# Altium schematic sheet IM.SchDoc: SIGMA-TEAM
size A2; DrawnBy: zfz; Revision: V1.0; SheetNumber: 1; SheetTotal: 1
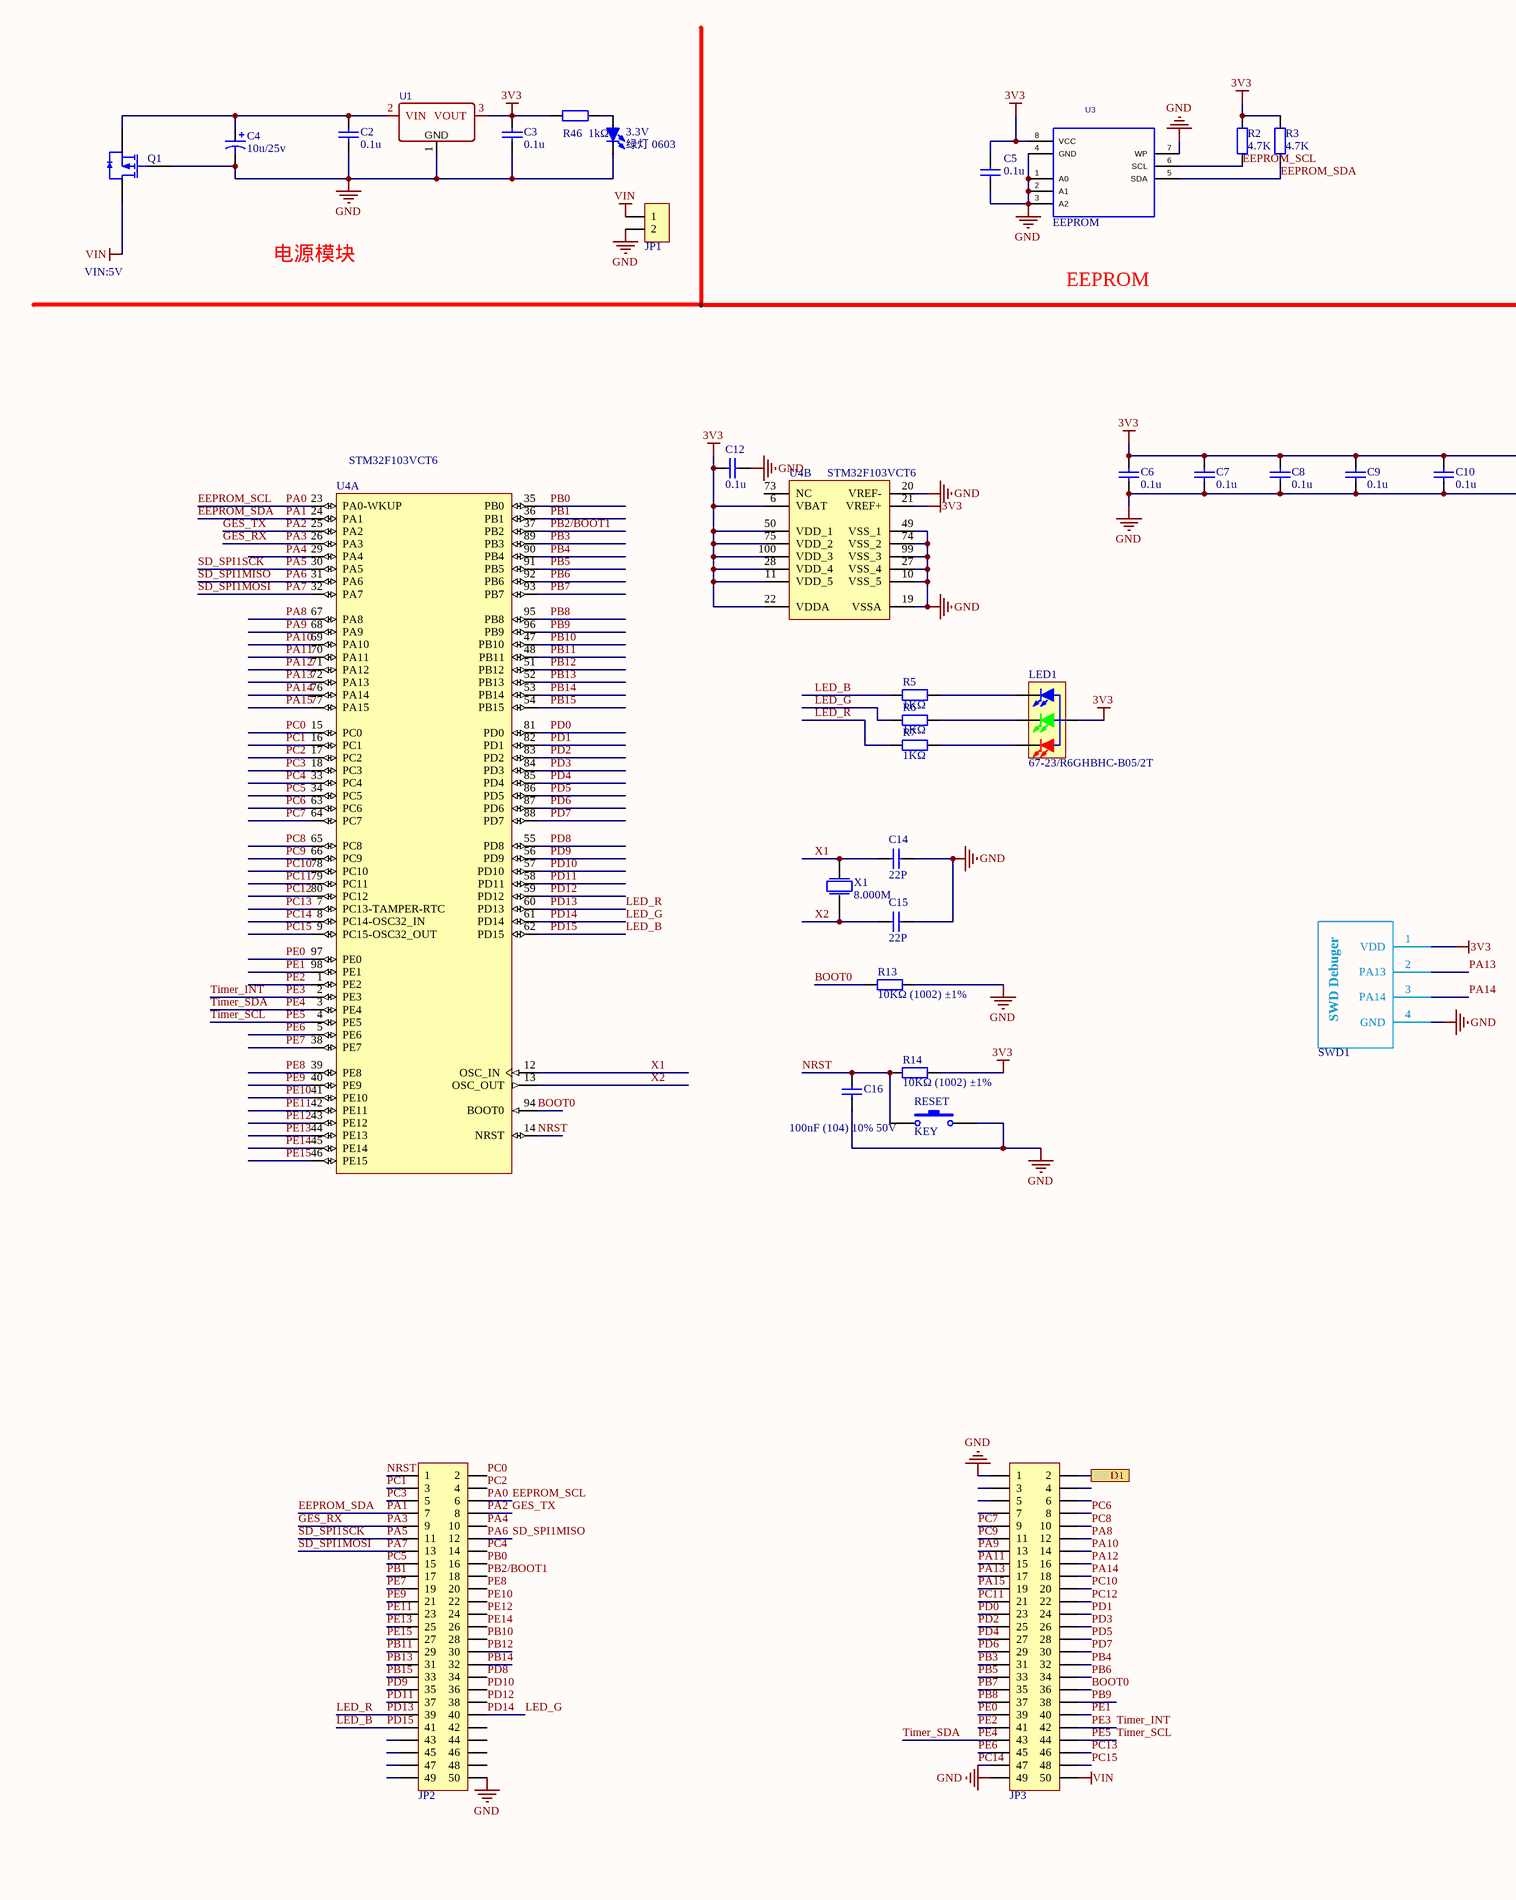
[diagram p0: IM.SchDoc, left]
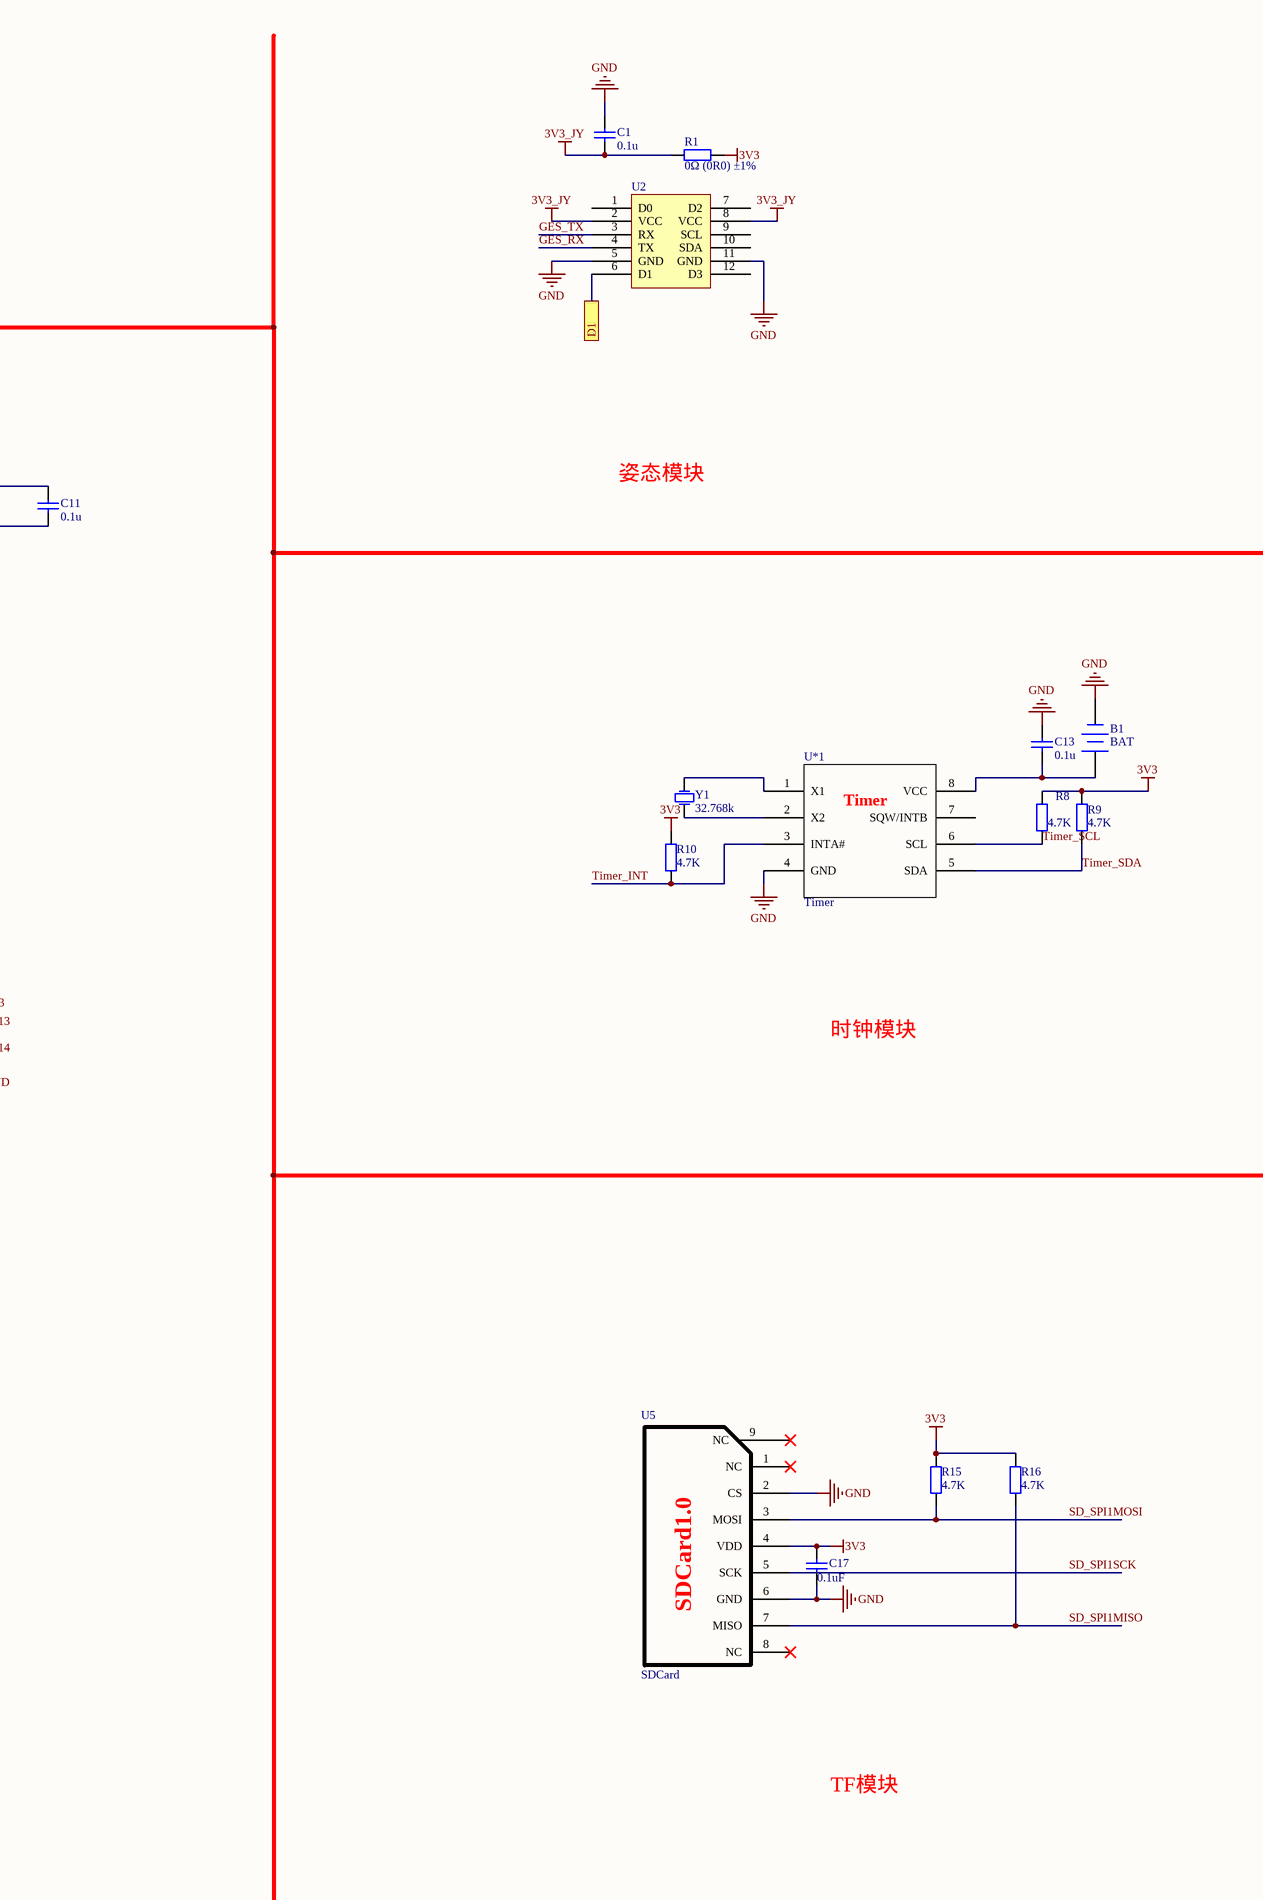
[diagram p1: IM.SchDoc, right]

## Parts
3.3V  绿灯 0603  [0603_LED]
B1  BAT  [BAT]
C1  0.1u  [0603_C]
C2  0.1u  [0603_C]
C3  0.1u  [0603_C]
C4  10u/25v  [SMD-3225-2P]
C5  0.1u  [0603_C]
C6  0.1u  [0603_C]
C7  0.1u  [0603_C]
C8  0.1u  [0603_C]
C9  0.1u  [0603_C]
C10  0.1u  [0603_C]
C11  0.1u  [0603_C]
C12  0.1u  [0603_C]
C13  0.1u  [0603_C]
C14  22P  [0603_C]
C15  22P  [0603_C]
C16  100nF (104) 10% 50V  [0603_C]
C17  0.1uF  [0603_C]
JP1  HDR-1X2  [HDR2.54-LI-2P]  (value not drawn)
JP2  Header 2X25  [HDR2.54-LI-2X25P]  (value not drawn)
JP3  Header 2X25  [HDR2.54-LI-2X25P]  (value not drawn)
LED1  67-23/R6GHBHC-B05/2T  [LED 3528-4Pin]
Q1  AO3401A P道沟  [SOT-23(SOT-23-3)]  (value not drawn)
R1  0Ω (0R0) ±1%  [0603_R]
R2  4.7K  [0603_R]
R3  4.7K  [0603_R]
R5  1KΩ  [0603_R]
R6  1KΩ  [0603_R]
R7  1KΩ  [0603_R]
R8  4.7K  [0603_R]
R9  4.7K  [0603_R]
R10  4.7K  [0603_R]
R13  10KΩ (1002) ±1%  [0603_R]
R14  10KΩ (1002) ±1%  [0603_R]
R15  4.7K  [0603_R]
R16  4.7K  [0603_R]
R46  1kΩ  [0603_R]
RESET  KEY  [key-2]
SWD1  SWD  [HDR2.54-LI-4P]  (value not drawn)
U1  HT7533/ME6210A33PG  [SOT-89(SOT-89-3)]  (value not drawn)
U2  JY901  [JY-901]  (value not drawn)
U3  value EEPROM  [SOP8_N]  (hidden comment: AT24C02)
U4  STM32F103VCT6  [LQFP100 14x14_N]  (parts A,B of 2)
U5  SDCard  [TF-Micro]
U*1  Timer
X1  8.000M  [OSC 5032-2P]
Y1  value 32.768k  [OSC 3215-2P]  (hidden comment: 无源晶振)

## Ports
D1

## Nets
3V3: C3.2 C5.2 C6.2 C7.2 C8.2 C9.2 C10.2 C11.2 C12.1 C17.1 LED1.4(A) R1.2 R2.1 R3.1 R8.2 R9.2 R10.2 R14.2 R15.1 R16.1 R46.1 SWD1.1(VDD) U1.3(VOUT) U3.8(VCC) U4.6(VBAT) U4.11(VDD_5) U4.21(VREF+) U4.22(VDDA) U4.28(VDD_4) U4.50(VDD_1) U4.75(VDD_2) U4.100(VDD_3) U5.4(VDD)
3V3_JY: C1.1 R1.1 U2.2(VCC) U2.8(VCC)
GND: 3.3V.K B1.2(-) C1.2 C2.1 C3.1 C4.2 C5.1 C6.1 C7.1 C8.1 C9.1 C10.1 C11.1 C12.2 C13.2 C14.2 C15.2 C16.1 C17.2 JP1.2 JP2.50 JP3.1 JP3.49 Q1.1(G) R13.2 RESET.2 SWD1.4(GND) U1.1(GND) U2.5(GND) U2.11(GND) U3.1(A0) U3.2(A1) U3.3(A2) U3.4(GND) U3.7(WP) U4.10(VSS_5) U4.19(VSSA) U4.20(VREF-) U4.27(VSS_4) U4.49(VSS_1) U4.74(VSS_2) U4.99(VSS_3) U5.2(CS) U5.6(GND) U*1.4(GND)
VIN: JP1.1 JP3.50 Q1.3(D)
BOOT0: JP3.36 R13.1 U4.94(BOOT0)
D1: JP3.2 U2.6(D1) ; port D1
EEPROM_SCL: JP2.6 R2.2 U3.6(SCL) U4.23(PA0-WKUP)  [also labelled PA0]
EEPROM_SDA: JP2.7 R3.2 U3.5(SDA) U4.24(PA1)  [also labelled PA1]
GES_RX: JP2.9 U2.4(TX) U4.26(PA3)  [also labelled PA3]
GES_TX: JP2.8 U2.3(RX) U4.25(PA2)  [also labelled PA2]
LED_B: JP2.41 R5.1 U4.62(PD15)  [also labelled PD15]
LED_G: JP2.40 R6.1 U4.61(PD14)  [also labelled PD14]
LED_R: JP2.39 R7.1 U4.60(PD13)  [also labelled PD13]
NRST: C16.2 JP2.1 R14.1 RESET.1 U4.14(NRST)
PA4: JP2.10 U4.29(PA4)
PA5: JP2.11 U4.30(PA5) U5.5(SCK)  [also labelled SD_SPI1SCK]
PA6: JP2.12 R16.2 U4.31(PA6) U5.7(MISO)  [also labelled SD_SPI1MISO]
PA7: JP2.13 R15.2 U4.32(PA7) U5.3(MOSI)  [also labelled SD_SPI1MOSI]
PA8: JP3.12 U4.67(PA8)
PA9: JP3.13 U4.68(PA9)
PA10: JP3.14 U4.69(PA10)
PA11: JP3.15 U4.70(PA11)
PA12: JP3.16 U4.71(PA12)
PA13: JP3.17 SWD1.2(PA13) U4.72(PA13)
PA14: JP3.18 SWD1.3(PA14) U4.76(PA14)
PA15: JP3.19 U4.77(PA15)
PB0: JP2.16 U4.35(PB0)
PB1: JP2.17 U4.36(PB1)
PB2/BOOT1: JP2.18 U4.37(PB2)
PB3: JP3.31 U4.89(PB3)
PB4: JP3.32 U4.90(PB4)
PB5: JP3.33 U4.91(PB5)
PB6: JP3.34 U4.92(PB6)
PB7: JP3.35 U4.93(PB7)
PB8: JP3.37 U4.95(PB8)
PB9: JP3.38 U4.96(PB9)
PB10: JP2.28 U4.47(PB10)
PB11: JP2.29 U4.48(PB11)
PB12: JP2.30 U4.51(PB12)
PB13: JP2.31 U4.52(PB13)
PB14: JP2.32 U4.53(PB14)
PB15: JP2.33 U4.54(PB15)
PC0: JP2.2 U4.15(PC0)
PC1: JP2.3 U4.16(PC1)
PC2: JP2.4 U4.17(PC2)
PC3: JP2.5 U4.18(PC3)
PC4: JP2.14 U4.33(PC4)
PC5: JP2.15 U4.34(PC5)
PC6: JP3.8 U4.63(PC6)
PC7: JP3.9 U4.64(PC7)
PC8: JP3.10 U4.65(PC8)
PC9: JP3.11 U4.66(PC9)
PC10: JP3.20 U4.78(PC10)
PC11: JP3.21 U4.79(PC11)
PC12: JP3.22 U4.80(PC12)
PC13: JP3.46 U4.7(PC13-TAMPER-RTC)
PC14: JP3.47 U4.8(PC14-OSC32_IN)
PC15: JP3.48 U4.9(PC15-OSC32_OUT)
PD0: JP3.23 U4.81(PD0)
PD1: JP3.24 U4.82(PD1)
PD2: JP3.25 U4.83(PD2)
PD3: JP3.26 U4.84(PD3)
PD4: JP3.27 U4.85(PD4)
PD5: JP3.28 U4.86(PD5)
PD6: JP3.29 U4.87(PD6)
PD7: JP3.30 U4.88(PD7)
PD8: JP2.34 U4.55(PD8)
PD9: JP2.35 U4.56(PD9)
PD10: JP2.36 U4.57(PD10)
PD11: JP2.37 U4.58(PD11)
PD12: JP2.38 U4.59(PD12)
PE0: JP3.39 U4.97(PE0)
PE1: JP3.40 U4.98(PE1)
PE2: JP3.41 U4.1(PE2)
PE3: JP3.42 R10.1 U4.2(PE3) U*1.3(INTA#)  [also labelled Timer_INT]
PE4: JP3.43 R9.1 U4.3(PE4) U*1.5(SDA)  [also labelled Timer_SDA]
PE5: JP3.44 R8.1 U4.4(PE5) U*1.6(SCL)  [also labelled Timer_SCL]
PE6: JP3.45 U4.5(PE6)
PE7: JP2.19 U4.38(PE7)
PE8: JP2.20 U4.39(PE8)
PE9: JP2.21 U4.40(PE9)
PE10: JP2.22 U4.41(PE10)
PE11: JP2.23 U4.42(PE11)
PE12: JP2.24 U4.43(PE12)
PE13: JP2.25 U4.44(PE13)
PE14: JP2.26 U4.45(PE14)
PE15: JP2.27 U4.46(PE15)
X1: C14.1 U4.12(OSC_IN) X1.2
X2: C15.1 U4.13(OSC_OUT) X1.1
Net3.3V_A: 3.3V.A R46.2
NetB1_1: B1.1(+) C13.1 U*1.8(VCC)
NetC2_2: C2.2 C4.1 Q1.2(S) U1.2(VIN)
NetLED1_1: LED1.1(RED_K) R7.2
NetLED1_2: LED1.2(GREEN_K) R6.2
NetLED1_3: LED1.3(BULE_K) R5.2
NetU*1_1: U*1.1(X1) Y1.2(OSC2)
NetU*1_2: U*1.2(X2) Y1.1(OSC1)

Not connected (* = marked no-connect by the designer): JP2 42 43 44 45 46 47 48 49; JP3 3 4 5 6 7; U2 1(D0) 7(D2) 9(SCL) 10(SDA) 12(D3); U4 73(NC); U5 1(NC)* 8(NC)* 9(NC)*; U*1 7(SQW/INTB)

## Notes on the sheet
- VIN:5V
- 电源模块
- EEPROM
- 姿态模块
- 时钟模块
- TF模块
- Title
- Size:
- Drawn by:
- File:
- A2
- Date:
- Sheet:
- Revision:
- of
- (in symbol SDCard) SDCard1.0
- (in symbol SWD) SWD Debuger

## Library data of the parts
3.3V = 0603 LED: 贴片LED; ComponentLink1Description: 供应商链接; ComponentLink1URL: http://www.szlcsc.com/product/details_2659.html; Package: 0603; Supplier: LC; SuppliersPartNumber: C2286
C1-C3 C5-C15 C17 = CAP0805
C4 = CAP[B]
C16 = 0603 100nF (104) 10% 50V: 贴片电容; ComponentLink1Description: 供应商链接; ComponentLink1URL: http://www.szlcsc.com/product/details_15331.html; Package: 0603; Supplier: LC; SuppliersPartNumber: C14663
JP1 = Header 2 Pitch2.54: 2P接插件; 版权归属: 源创客; BOM名称: 2P接插件; 学习资源: www.ooocke.com
JP2 JP3 = Header 25X2 Pitch2.54: 25*2P接插件; BOM名称: 20*2P接插件; 版权归属: 源创客; 学习资源: www.ooocke.com
LED1 = LED-RGB-3528: 三基色LED; 版权归属: 源创客; BOM名称: 三基色LED; 学习资源: www.ooocke.com
Q1 = AO3401A P道沟 X13A15 SOT-23: MOS(场效应管); ComponentLink1Description: 供应商链接; ComponentLink1URL: http://www.szlcsc.com/product/details_15801.html; Package: SOT-23; Supplier: LC; SuppliersPartNumber: C15127
R1 R46 = 0603 0Ω (0R0) 1%: 贴片电阻; ComponentLink1Description: 供应商链接; ComponentLink1URL: http://www.szlcsc.com/product/details_21903.html; Package: 0603; Supplier: LC; SuppliersPartNumber: C21189
R2 R3 R8-R10 R15 R16 = RES0805
R5-R7 = 0603 2.2KΩ (2201) 1%: 贴片电阻; ComponentLink1Description: 供应商链接; ComponentLink1URL: http://www.szlcsc.com/product/details_4597.html; Package: 0603; Supplier: LC; SuppliersPartNumber: C4190
R13 R14 = 0603 10KΩ (1002) 1%: 贴片电阻; ComponentLink1Description: 供应商链接; ComponentLink1URL: http://www.szlcsc.com/product/details_26547.html; Package: 0603; Supplier: LC; SuppliersPartNumber: C25804
RESET = KEY_2: Switch; Published: 24-Mar-1999; LatestRevisionDate: 17-Jul-2002; LatestRevisionNote: Re-released for DXP Platform.; PackageReference: SPST-2; Publisher: Altium Limited
U1 = SOT-89 HT7533/ME6210A33PG: 低压差线性稳压(LDO); BOM_Manufacturer: HOLTEK; BOM_Manufacturer Part: HT7533; SMT Type: Extend; BOM_Supplier: LCSC; BOM_Supplier Part: C89203; BOM_LCSC Assembly: Yes; spicePre: U
U2 = JY61P/JY901B: 姿态模块
U3 = AT24C02: 8 lead ssop,2k/2048bits; Manufacturer #1: ATMEL; Manufacturer #1 PN: AT24C02; Descrpit: 2k/2048bits
U4 = STM32F100VET6: STM32 ARM-based 32-bit MCU Value Line with 512 kB Flash, 32 kB Internal RAM, -40 to +85癈 Temperature, 100-Pin LQFP, Tray; DatasheetVersion: rev5.0, Apr-2011; PackageVersion: rev13, Apr-2011; PackageReference: LQFP100; PackageDescription: 100-Pin Low-Profile Quad Flat Pack, 14 x 14 mm Body, 0.5 mm Pitch (LQFP100); ComponentLink1Description: Manufacturer URL; ComponentLink1URL: http://www.st.com/; ComponentLink2Description: STM32F100 Datasheet; ComponentLink2URL: http://www.st.com/internet/com/TECHNICAL_RESOURCES/TECHNICAL_LITERATURE/DATASHEET/CD00212417.pdf; ComponentLink3Description: STM32 Family Web Page; ComponentLink3URL: www.st.com/stm32
X1 = XTALSOP
Y1 = XTAL: Crystal Oscillator; Published: 8-Jun-2000; LatestRevisionDate: 17-Jul-2002; LatestRevisionNote: Re-released for DXP Platform.; PackageReference: R38; Publisher: Altium Limited